# EAGLE design SOT23_Vert (EAGLE 9.6.2)
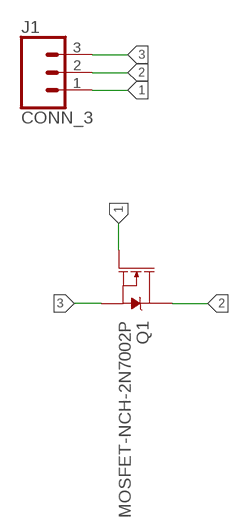
[diagram p0: schematic, sheet 1]

## Parts
J1  CONN_3  [1X03]
Q1  MOSFET-NCH-2N7002P  [SOT23-3]

## Nets
1: J1.1 Q1.1(G)
2: J1.2 Q1.3(D)
3: J1.3 Q1.2(S)

## Library data of the parts
J1 = bschulz:CONN_3: Genaric 3 terminal header Digikey 2.54_SCREW <https://www.digikey.com/product-detail/en/on-shore-technology-inc/OSTVN03A150/ED10562-ND/1588863> 3.5_SCREW <https://www.digikey.com/product-detail/en/on-shore-technology-inc/OSTTE030161/ED2636-ND/614585>
Q1 = bschulz:MOSFET-NCH: N-channel MOSFETs Voltage controlled devices that allow control of high current outputs. SparkFun Products: SparkFun OpenScale <https://www.sparkfun.com/products/13261> SparkFun Digital Sandbox <https://www.sparkfun.com/products/12651> SparkFun Monster Moto Shield <https://www.sparkfun.com/products/10182> SparkFun MOSFET Power Controller <https://www.sparkfun.com/products/11214>; DIGIKEY: 1727-4692-1-ND; MF: Nexperia; MPN: 2N7002P,215

## Board
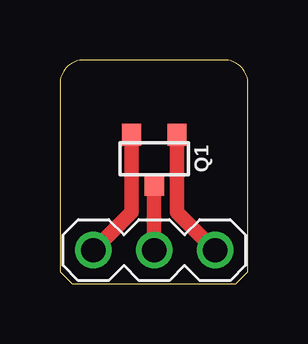
[diagram p1: board, top side]

Size 7.85 x 9.32 mm. Coordinates in mm from the lower left corner, seen from the top.
Outline: 6.85,9.32 1,9.32 arc90 0,8.32 0,0.5 0.5,0 7.35,0 7.85,0.5 7.85,8.32 arc90 6.85,9.32
Copper layers (1*16): Top 0.035559375mm / dielectric 1.6mm / Bottom 0.035559375mm
Design rules "oshpark-2layer": minimum track width 6mil, minimum drill 10mil, track to track 6mil, track to pad 6mil, pad to pad 6mil, via to via 6mil, smd to smd 6mil, copper to edge 15mil, drill to drill 6mil, minimum pad ring 5mil, minimum via ring 5mil, stop-mask expansion 2.5mil, vias tented up to drill 0mil, thermal gap 10mil

### Footprints (pad centres in the part's own frame; a part is rotated, then mirrored left to right if it is on the bottom)
1X03 = drill 1.016: 1 -2.54,0; 2 0,0; 3 2.54,0
SOT23-3 = smd 0.8 x 0.9: 1 -0.95,-1; 2 0.95,-1; 3 0,1.1

### Placement (x,y rotation side)
J1  3.94,1.4 180 top
Q1  3.94,5.21 180 top

### Tracks (layer width: path | path; a pad name or v marks a point on that pad's centre or on a via)
1
  Top 0.61: Q1.1 4.89,2.99 J1.1
2
  Top 0.61: Q1.3 J1.2
3
  Top 0.61: Q1.2 2.99,2.99 J1.3

### Text on the board
tDocu: SOT23 | B. Schulz
bDocu: Break44